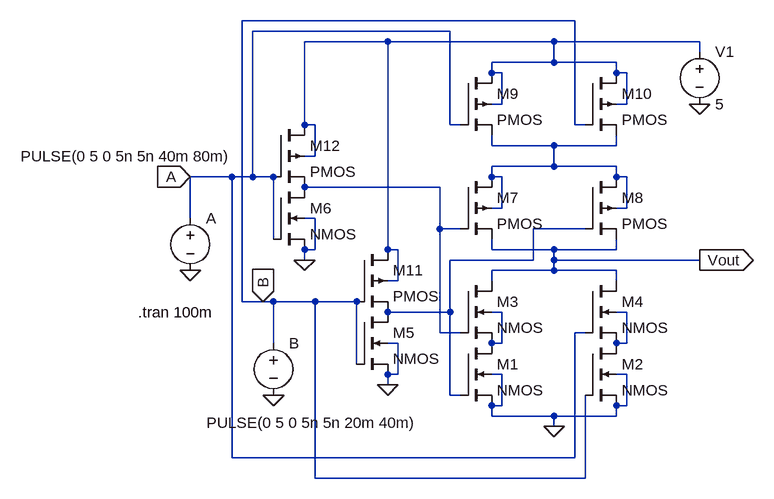
[diagram p0: schematic XOR.asc]
XOR.asc, the LTspice schematic file:
Version 4.1
SHEET 1 936 680
WIRE 352 -336 -160 -336
WIRE 160 -320 -144 -320
WIRE 64 -304 -64 -304
WIRE 320 -304 64 -304
WIRE 544 -304 320 -304
WIRE 544 -288 544 -304
WIRE 320 -272 320 -304
WIRE 320 -272 224 -272
WIRE 416 -272 320 -272
WIRE 224 -256 224 -272
WIRE 240 -256 224 -256
WIRE 416 -256 416 -272
WIRE 432 -256 416 -256
WIRE 240 -208 240 -256
WIRE 240 -208 224 -208
WIRE 432 -208 432 -256
WIRE 432 -208 416 -208
WIRE -64 -176 -64 -304
WIRE -48 -176 -64 -176
WIRE 160 -176 160 -320
WIRE 176 -176 160 -176
WIRE 352 -176 352 -336
WIRE 368 -176 352 -176
WIRE 224 -144 224 -160
WIRE 320 -144 224 -144
WIRE 416 -144 416 -160
WIRE 416 -144 320 -144
WIRE -48 -128 -48 -176
WIRE -48 -128 -64 -128
WIRE 320 -112 320 -144
WIRE 320 -112 224 -112
WIRE 416 -112 320 -112
WIRE -176 -96 -240 -96
WIRE -144 -96 -144 -320
WIRE -144 -96 -176 -96
WIRE -112 -96 -144 -96
WIRE 224 -96 224 -112
WIRE 240 -96 224 -96
WIRE 416 -96 416 -112
WIRE 432 -96 416 -96
WIRE 144 -80 -64 -80
WIRE 240 -48 240 -96
WIRE 240 -48 224 -48
WIRE 432 -48 432 -96
WIRE 432 -48 416 -48
WIRE -240 -32 -240 -96
WIRE -48 -32 -64 -32
WIRE 144 -16 144 -80
WIRE 176 -16 144 -16
WIRE 368 -16 288 -16
WIRE -112 0 -112 -96
WIRE -48 16 -48 -32
WIRE -48 16 -64 16
WIRE 64 16 64 -304
WIRE 80 16 64 16
WIRE 224 16 224 0
WIRE 320 16 224 16
WIRE 416 16 416 0
WIRE 416 16 320 16
WIRE -64 32 -64 16
WIRE 288 32 288 -16
WIRE 288 32 160 32
WIRE 320 32 320 16
WIRE 544 32 320 32
WIRE 320 48 320 32
WIRE 320 48 224 48
WIRE 416 48 320 48
WIRE 80 64 80 16
WIRE 80 64 64 64
WIRE 224 64 224 48
WIRE 416 64 416 48
WIRE -160 96 -160 -336
WIRE -128 96 -160 96
WIRE -112 96 -128 96
WIRE -48 96 -112 96
WIRE 16 96 -48 96
WIRE 160 112 160 32
WIRE 160 112 64 112
WIRE 240 112 224 112
WIRE 432 112 416 112
WIRE 144 144 144 -16
WIRE 176 144 144 144
WIRE 368 144 352 144
WIRE -112 160 -112 96
WIRE 80 160 64 160
WIRE 240 160 240 112
WIRE 240 160 224 160
WIRE 432 160 432 112
WIRE 432 160 416 160
WIRE 16 192 16 96
WIRE 80 208 80 160
WIRE 80 208 64 208
WIRE 240 208 224 208
WIRE 432 208 416 208
WIRE 64 224 64 208
WIRE 160 240 160 112
WIRE 176 240 160 240
WIRE 240 256 240 208
WIRE 240 256 224 256
WIRE 432 256 432 208
WIRE 432 256 416 256
WIRE 224 272 224 256
WIRE 320 272 224 272
WIRE 416 272 416 256
WIRE 416 272 320 272
WIRE 320 288 320 272
WIRE -176 336 -176 -96
WIRE 352 336 352 144
WIRE 352 336 -176 336
WIRE -48 368 -48 96
WIRE 368 368 368 240
WIRE 368 368 -48 368
FLAG -64 32 0
FLAG -240 48 0
FLAG -112 240 0
FLAG 64 224 0
FLAG 544 -208 0
FLAG 320 288 0
FLAG 544 32 Vout
IOPIN 544 32 Out
FLAG -240 -96 A
IOPIN -240 -96 In
FLAG -128 96 B
IOPIN -128 96 In
SYMBOL nmos4 176 160 R0
SYMATTR InstName M1
SYMBOL nmos4 368 160 R0
SYMATTR InstName M2
SYMBOL nmos4 176 64 R0
SYMATTR InstName M3
SYMBOL nmos4 368 64 R0
SYMATTR InstName M4
SYMBOL nmos4 16 112 R0
SYMATTR InstName M5
SYMBOL nmos4 -112 -80 R0
SYMATTR InstName M6
SYMBOL pmos4 176 -96 R0
SYMATTR InstName M7
SYMBOL pmos4 368 -96 R0
SYMATTR InstName M8
SYMBOL pmos4 176 -256 R0
SYMATTR InstName M9
SYMBOL pmos4 368 -256 R0
SYMATTR InstName M10
SYMBOL pmos4 16 16 R0
SYMATTR InstName M11
SYMBOL pmos4 -112 -176 R0
SYMATTR InstName M12
SYMBOL voltage -240 -48 R0
WINDOW 3 -261 -80 Left 2
WINDOW 123 0 0 Left 0
WINDOW 39 0 0 Left 0
SYMATTR InstName A
SYMATTR Value PULSE(0 5 0 5n 5n 40m 80m)
SYMBOL voltage -112 144 R0
WINDOW 3 -103 138 Left 2
WINDOW 123 0 0 Left 0
WINDOW 39 0 0 Left 0
SYMATTR InstName B
SYMATTR Value PULSE(0 5 0 5n 5n 20m 40m)
SYMBOL voltage 544 -304 R0
WINDOW 123 0 0 Left 0
WINDOW 39 0 0 Left 0
SYMATTR InstName V1
SYMATTR Value 5
TEXT -320 112 Left 2 !.tran 100m

The netlist it stands for:
* XOR.asc
M1 N005 N004 0 0 NMOS
M2 N006 B 0 0 NMOS
M3 Vout N003 N005 N005 NMOS
M4 Vout A N006 N006 NMOS
M5 N004 B 0 0 NMOS
M6 N003 A 0 0 NMOS
M7 N002 N003 Vout N002 PMOS
M8 N002 N004 Vout N002 PMOS
M9 N001 A N002 N001 PMOS
M10 N001 B N002 N001 PMOS
M11 N001 B N004 N001 PMOS
M12 N001 A N003 N001 PMOS
V§A A 0 PULSE(0 5 0 5n 5n 40m 80m)
V§B B 0 PULSE(0 5 0 5n 5n 20m 40m)
V1 N001 0 5
.model NMOS NMOS
.model PMOS PMOS
.lib standard.mos
.tran 100m
.backanno
.end